# Altium schematic sheet 04.1_Temp_Sensor_Info.SchDoc
size A4; SheetNumber: 4; SheetTotal: 8
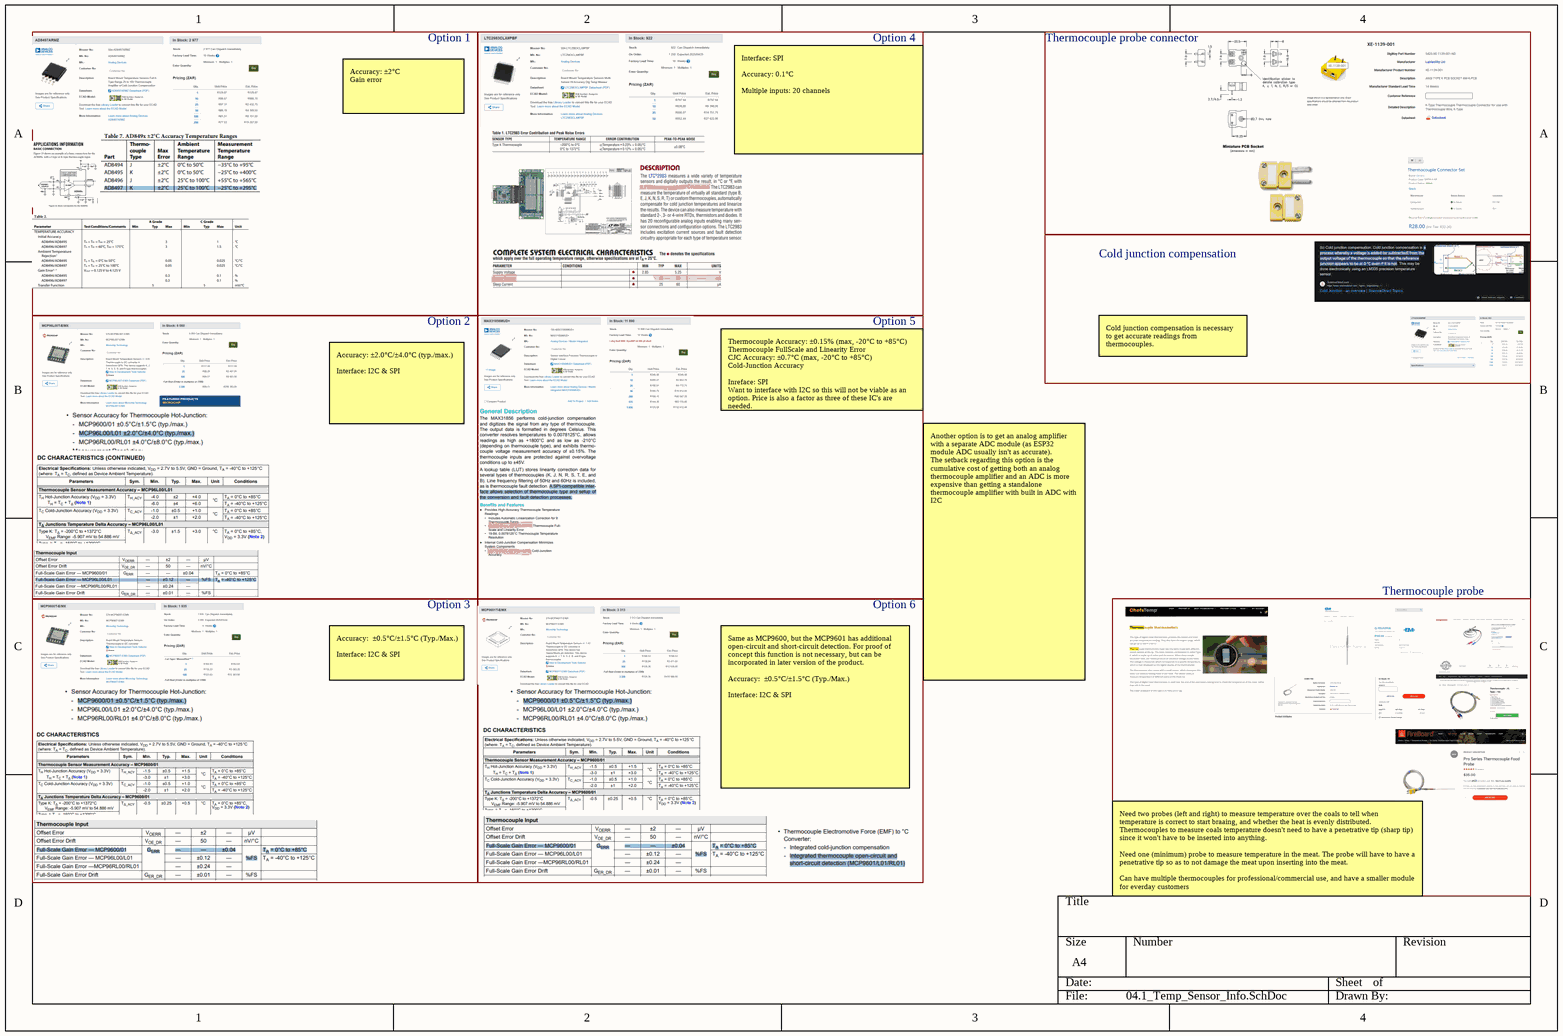
[diagram p0: 04.1_Temp_Sensor_Info.SchDoc]

## Notes on the sheet
- Option 1
- Option 4
- Thermocouple probe connector
- Accuracy: ±2°C
  Gain error
- Interface: SPI
  Accuracy: 0.1°C
  Multiple inputs: 20 channels
- Cold junction compensation
- Option 2
- Option 5
- Cold junction compensation is necessary to get accurate readings from thermocouples.
- Accuracy: ±2.0°C/±4.0°C (typ./max.)
  Interface: I2C & SPI
- Thermocouple Accuracy: ±0.15% (max, -20°C to +85°C) Thermocouple FullScale and Linearity Error
  CJC Accuracy: ±0.7°C (max, -20°C to +85°C) Cold-Junction Accuracy
  Inreface: SPI
  Want to interface with I2C so this will not be viable as an option. Price is also a factor as three of these IC's are needed.
- Option 3
- Option 6
- Thermocouple probe
- Accuracy:  ±0.5°C/±1.5°C (Typ./Max.)
  Interface: I2C & SPI
- Another option is to get an analog amplifier with a separate ADC module (as ESP32 module ADC usually isn't as accurate).
  The setback regarding this option is the cumulative cost of getting both an analog thermocouple amplifier and an ADC is more expensive than getting a standalone thermocouple amplifier with built in ADC with I2C
- Same as MCP9600, but the MCP9601 has additional open-circuit and short-circuit detection. For proof of concept this function is not necessary, but can be incorporated in later version of the product.
  Accuracy:  ±0.5°C/±1.5°C (Typ./Max.)
  Interface: I2C & SPI
- Need two probes (left and right) to measure temperature over the coals to tell when temperature is correct to start braaing, and whether the heat is evenly distributed. Thermocouples to measure coals temperature doesn't need to have a penetrative tip (sharp tip) since it won't have to be inserted into anything.
  Need one (minimum) probe to measure temperature in the meat. The probe will have to have a penetrative tip so as to not damage the meat upon inserting into the meat.
  Can have multiple thermocouples for professional/commercial use, and have a smaller module for everday customers